# Altium project BLDC controller.PrjPcb
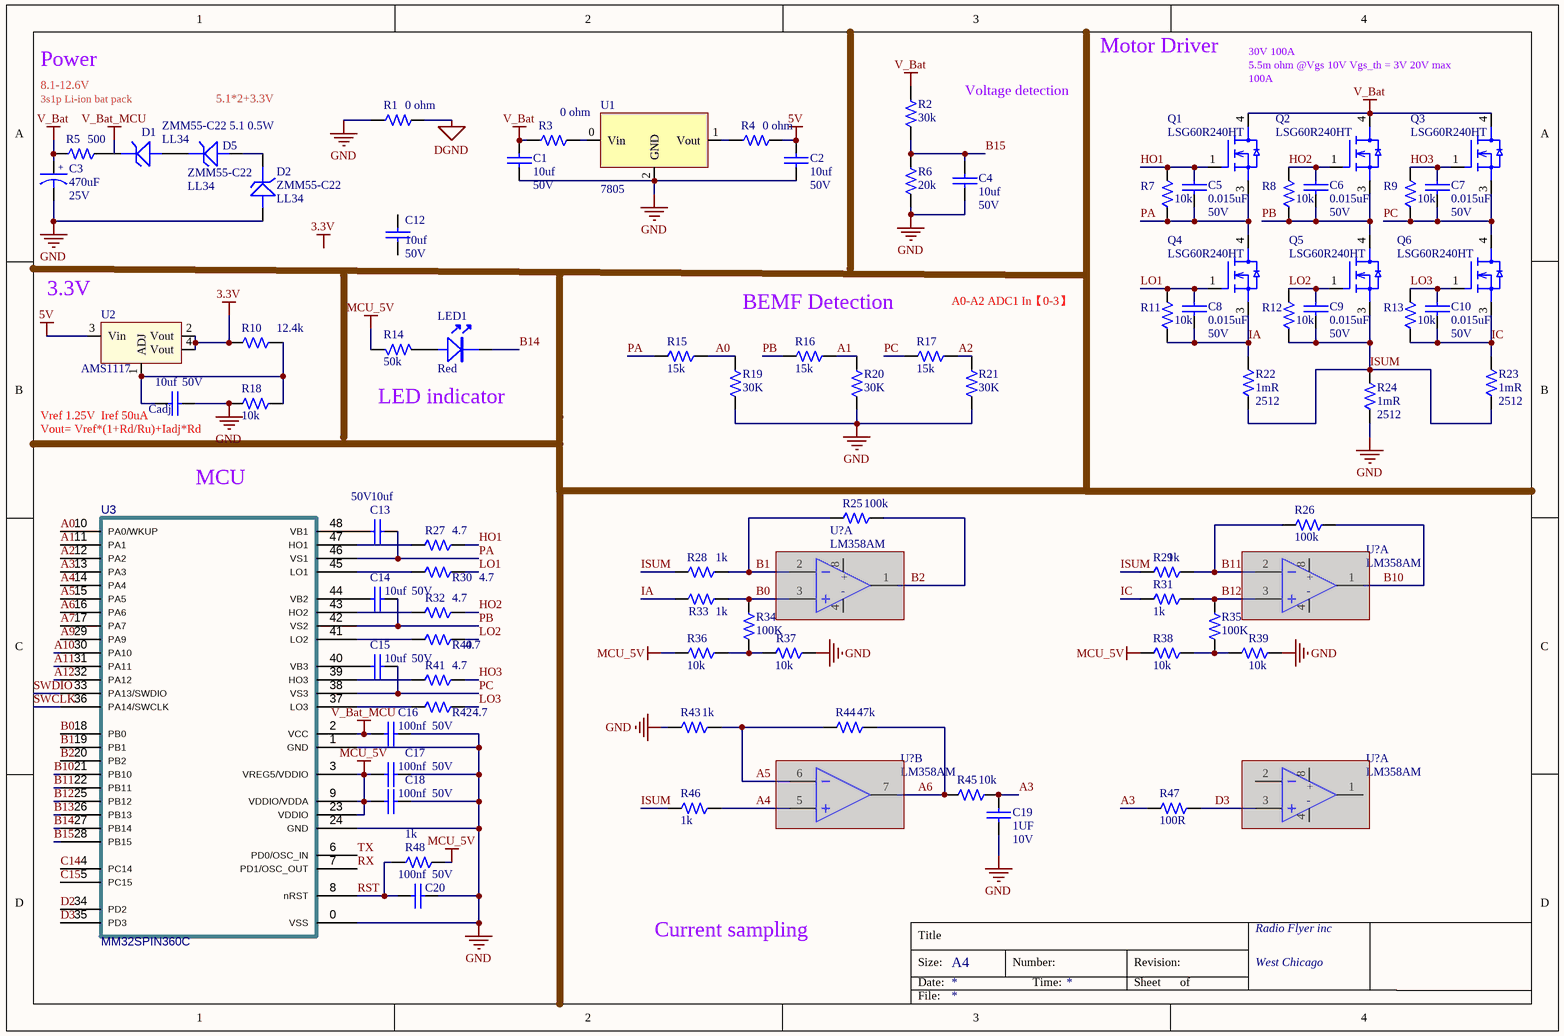
[diagram p0: E-scooter.SchDoc]
2 sheets, 124 parts. Net scope: global (net labels, ports and power ports of the same name join across sheets).
Board file: BLDC controller.PcbDoc
Sheets:
  E-scooter.SchDoc
  Connector.SchDoc

## Sheet E-scooter.SchDoc
size A4; Organization: Altium Limited; Address1: L3, 12a Rodborough Rd; Address2: Frenchs Forest; Address3: NSW; Address4: Australia 2086

### Parts
(Parts that share a designator on the sheet are numbered #1, #2 ... from top to bottom, then left to right.)
C1  value 10uf  Voltage: 50V  [CAPC0603-RW]  (hidden comment: PXL456470-1530)
C2  value 10uf  Voltage: 50V  [CAPC0603-RW]  (hidden comment: PXL456470-1530)
C3  value 470uF  Voltage: 25V  [CASE - G]  (hidden comment: PBE099550-4710)
C4  value 10uf  Voltage: 50V  [CAPC0603-RW]  (hidden comment: PXL456470-1530)
C5  value 0.015uF  Voltage: 50V  [CAPC0603-RW]  (hidden comment: PXL456470-1530)
C6  value 0.015uF  Voltage: 50V  [CAPC0603-RW]  (hidden comment: PXL456470-1530)
C7  value 0.015uF  Voltage: 50V  [CAPC0603-RW]  (hidden comment: PXL456470-1530)
C8  value 0.015uF  Voltage: 50V  [CAPC0603-RW]  (hidden comment: PXL456470-1530)
C9  value 0.015uF  Voltage: 50V  [CAPC0603-RW]  (hidden comment: PXL456470-1530)
C10  value 0.015uF  Voltage: 50V  [CAPC0603-RW]  (hidden comment: PXL456470-1530)
C12  value 10uf  Voltage: 50V  [CAPC0603-RW]  (hidden comment: PXL456470-1530)
C13  value 10uf  Voltage: 50V  [CAPC0603-RW]  (hidden comment: PXL456470-1530)
C14  value 10uf  Voltage: 50V  [CAPC0603-RW]  (hidden comment: PXL456470-1530)
C15  value 10uf  Voltage: 50V  [CAPC0603-RW]  (hidden comment: PXL456470-1530)
C16  value 100nf  Voltage: 50V  [CAPC0603-RW]  (hidden comment: PXL456470-1530)
C17  value 100nf  Voltage: 50V  [CAPC0603-RW]  (hidden comment: PXL456470-1530)
C18  value 100nf  Voltage: 50V  [CAPC0603-RW]  (hidden comment: PXL456470-1530)
C19  value 1UF  Voltage: 10V  [CAPC0603-RW]  (hidden comment: PXL456470-1530)
C20  value 100nf  Voltage: 50V  [CAPC0603-RW]  (hidden comment: PXL456470-1530)
Cadj  value 10uf  Voltage: 50V  [CAPC0603-RW]  (hidden comment: PXL456470-1530)
D1  MFG Part: ZMM55-C22 5.1 0.5W  [LL34]  (hidden comment: RCZ005022-0010)
D2  MFG Part: ZMM55-C22  [LL34]  (hidden comment: RCZ005022-0010)
D5  MFG Part: ZMM55-C22  [LL34]  (hidden comment: RCZ005022-0010)
LED1  Color: Red  [LED1206-RED]  (hidden comment: LED1206R_23-21\R6C-AM1N2AY\2A)
Q1  MFG Part: LSG60R240HT  [TO252-3]  (hidden comment: T5860038503A6)
Q2  MFG Part: LSG60R240HT  [TO252-3]  (hidden comment: T5860038503A6)
Q3  MFG Part: LSG60R240HT  [TO252-3]  (hidden comment: T5860038503A6)
Q4  MFG Part: LSG60R240HT  [TO252-3]  (hidden comment: T5860038503A6)
Q5  MFG Part: LSG60R240HT  [TO252-3]  (hidden comment: T5860038503A6)
Q6  MFG Part: LSG60R240HT  [TO252-3]  (hidden comment: T5860038503A6)
R1  value 0 ohm  [0603-RW]  (hidden comment: T502210202399)
R2  value 30k  [0603]  (hidden comment: T5024421083A9)
R3  value 0 ohm  [0603-RW]  (hidden comment: T502210202399)
R4  value 0 ohm  [0603-RW]  (hidden comment: T502210202399)
R5  value 500  [0603-RW]  (hidden comment: T502210202399)
R6  value 20k  [0603]  (hidden comment: T5024421083A9)
R7  value 10k  [0603]  (hidden comment: T5024421083A9)
R8  value 10k  [0603]  (hidden comment: T5024421083A9)
R9  value 10k  [0603]  (hidden comment: T5024421083A9)
R10  value 12.4k  [0603]  (hidden comment: T5024421083A9)
R11  value 10k  [0603]  (hidden comment: T5024421083A9)
R12  value 10k  [0603]  (hidden comment: T5024421083A9)
R13  value 10k  [0603]  (hidden comment: T5024421083A9)
R14  value 50k  [0603]  (hidden comment: T5024421083A9)
R15  value 15k  [0603]  (hidden comment: T5024421083A9)
R16  value 15k  [0603]  (hidden comment: T5024421083A9)
R17  value 15k  [0603]  (hidden comment: T5024421083A9)
R18  value 10k  [0603]  (hidden comment: T5024421083A9)
R19  value 30K  [0603]  (hidden comment: T5024421083A9)
R20  value 30K  [0603]  (hidden comment: T5024421083A9)
R21  value 30K  [0603]  (hidden comment: T5024421083A9)
R22  value 1mR  [2512]  (hidden comment: QCF101250-1009)
R23  value 1mR  [2512]  (hidden comment: QCF101250-1009)
R24  value 1mR  [2512]  (hidden comment: QCF101250-1009)
R25  value 100k  [0603]  (hidden comment: T5024421083A9)
R26  value 100k  [0603]  (hidden comment: T5024421083A9)
R27  value 4.7  [0603]  (hidden comment: T5024421083A9)
R28  value 1k  [0603]  (hidden comment: T5024421083A9)
R29  value 1k  [0603]  (hidden comment: T5024421083A9)
R30  value 4.7  [0603]  (hidden comment: T5024421083A9)
R31  value 1k  [0603]  (hidden comment: T5024421083A9)
R32  value 4.7  [0603]  (hidden comment: T5024421083A9)
R33  value 1k  [0603]  (hidden comment: T5024421083A9)
R34  value 100K  [0603]  (hidden comment: T5024421083A9)
R35  value 100K  [0603]  (hidden comment: T5024421083A9)
R36  value 10k  [0603]  (hidden comment: T5024421083A9)
R37  value 10k  [0603]  (hidden comment: T5024421083A9)
R38  value 10k  [0603]  (hidden comment: T5024421083A9)
R39  value 10k  [0603]  (hidden comment: T5024421083A9)
R40  value 4.7  [0603]  (hidden comment: T5024421083A9)
R41  value 4.7  [0603]  (hidden comment: T5024421083A9)
R42  value 4.7  [0603]  (hidden comment: T5024421083A9)
R43  value 1k  [0603]  (hidden comment: T5024421083A9)
R44  value 47k  [0603]  (hidden comment: T5024421083A9)
R45  value 10k  [0603]  (hidden comment: T5024421083A9)
R46  value 1k  [0603]  (hidden comment: T5024421083A9)
R47  value 100R  [0603]  (hidden comment: T5024421083A9)
R48  value 1k  [0603]  (hidden comment: T5024421083A9)
U1  7805  [TO-263]
U2  AMS1117  [SOT223]
U3  MM32SPIN360C  [QFN48-6x6]
U?#1  MFG Part: LM358AM  [SO8]  (hidden comment: T610500042101)  (part A of 2)  (masked out: inside a compile mask, not in the netlist)
U?#2  MFG Part: LM358AM  [SO8]  (hidden comment: T610500042101)  (part A of 2)  (masked out: inside a compile mask, not in the netlist)
U?#3  MFG Part: LM358AM  [SO8]  (hidden comment: T610500042101)  (part B of 2)  (masked out: inside a compile mask, not in the netlist)
U?#4  MFG Part: LM358AM  [SO8]  (hidden comment: T610500042101)  (part A of 2)  (masked out: inside a compile mask, not in the netlist)

### Nets
3.3V: R10.2 U2.2(Vout) U2.4(Vout)
5V: C2.1 R4.2 U2.3(Vin)
DGND: R1.2
GND: C1.2 C2.2 C3.2 C4.2 C16.1 C17.1 C18.1 C19.1 C20.1 Cadj.2 D2.1(A) R1.1 R6.2 R18.2 R19.2 R20.2 R21.2 R24.1 R37.1 R39.1 R43.2 U1.2(GND) U3.0(VSS) U3.1(GND) U3.24(GND)
MCU_5V: C17.2 C18.2 R14.1 R36.2 R38.2 R48.2 U3.3(VREG5/VDDIO) U3.9(VDDIO/VDDA) U3.23(VDDIO)
V_Bat: C1.1 C3.1 Q1.4(D) Q2.4(D) Q3.4(D) R2.1 R3.1 R5.1
V_Bat_MCU: C16.2 U3.2(VCC)
A0: R15.1 R19.1 U3.10(PA0/WKUP)
A1: R16.1 R20.1 U3.11(PA1)
A2: R17.1 R21.1 U3.12(PA2)
A3: C19.2 R45.1 R47.2 U3.13(PA3)
A4: R46.1 U3.14(PA4)
A5: R43.1 R44.2 U3.15(PA5)
A6: R44.1 R45.2 U3.16(PA6)
A7: U3.17(PA7)
A9: U3.29(PA9)
A10: U3.30(PA10)
A11: U3.31(PA11)
A12: U3.32(PA12)
B0: R33.1 R34.1 U3.18(PB0)
B1: R25.2 R28.1 U3.19(PB1)
B2: R25.1 U3.20(PB2)
B10: R26.1 U3.21(PB10)
B11: R26.2 R29.1 U3.22(PB11)
B12: R31.1 R35.1 U3.25(PB12)
B13: U3.26(PB13)
B14: LED1.2(K) U3.27(PB14)
B15: C4.1 R2.2 R6.1 U3.28(PB15)
C14: U3.4(PC14)
C15: U3.5(PC15)
D2: U3.34(PD2)
D3: R47.1 U3.35(PD3)
HO1: C5.2 Q1.1(G) R7.2 R27.1
HO2: C6.2 Q2.1(G) R8.2 R32.1
HO3: C7.2 Q3.1(G) R9.2 R41.1
IA: C8.1 Q4.3(S) R11.1 R22.2 R33.2
IC: C10.1 Q6.3(S) R13.1 R23.2 R31.2
ISUM: C9.1 Q5.3(S) R12.1 R22.1 R23.1 R24.2 R28.2 R29.2 R46.2
LO1: C8.2 Q4.1(G) R11.2 R30.1
LO2: C9.2 Q5.1(G) R12.2 R40.1
LO3: C10.2 Q6.1(G) R13.2 R42.1
PA: C5.1 C13.1 Q1.3(S) Q4.4(D) R7.1 R15.2 U3.46(VS1)
PB: C6.1 C14.1 Q2.3(S) Q5.4(D) R8.1 R16.2 U3.42(VS2)
PC: C7.1 C15.1 Q3.3(S) Q6.4(D) R9.1 R17.2 U3.38(VS3)
RST: C20.2 R48.1 U3.8(nRST)
RX: U3.7(PD1/OSC_OUT)
SWCLK: U3.36(PA14/SWCLK)
SWDIO: U3.33(PA13/SWDIO)
TX: U3.6(PD0/OSC_IN)
NetC13_2: C13.2 U3.48(VB1)
NetC14_2: C14.2 U3.44(VB2)
NetC15_2: C15.2 U3.40(VB3)
NetCadj_1: Cadj.1 R10.1 R18.1 U2.1(ADJ)
NetD1_1: D1.1(A) D5.2(K)
NetD1_2: D1.2(K) R5.2
NetD2_2: D2.2(K) D5.1(A)
NetLED1_1: LED1.1(A) R14.2
NetR3_2: R3.2 U1.0(Vin)
NetR4_1: R4.1 U1.1(Vout)
NetR27_2: R27.2 U3.47(HO1)
NetR30_2: R30.2 U3.45(LO1)
NetR32_2: R32.2 U3.43(HO2)
NetR34_2: R34.2 R36.1 R37.2
NetR35_2: R35.2 R38.1 R39.2
NetR40_2: R40.2 U3.41(LO2)
NetR41_2: R41.2 U3.39(HO3)
NetR42_2: R42.2 U3.37(LO3)

Not connected (* = marked no-connect by the designer): C12 1 2

### Notes on the sheet
- Power
- 3s1p Li-ion bat pack
- 8.1-12.6V
- 5.1*2+3.3V
- Voltage detection
- Motor Driver
- 30V 100A
- 5.5m ohm @Vgs 10V Vgs_th = 3V 20V max
- (near Q1) 100A
- (near U2) 3.3V
- BEMF Detection
- A0-A2 ADC1 In【0-3】
- (near Cadj) Vref 1.25V  Iref 50uA
- (near Cadj) Vout= Vref*(1+Rd/Ru)+Iadj*Rd
- LED indicator
- (near U3) MCU
- Current sampling
- Labels drawn without touching a wire or pin: 3.3V
- Title
- Size:
- Date:
- A4
- Number:
- Time:
- Revision:
- Sheet
- of
- Radio Flyer inc
- West Chicago
- File:
- (in symbol CAP E 470uF 25V 20% SMD) +
- (in symbol LM358BAIDR, part A) +; -

### Library data of the parts
C1 C2 C4-C10 C12-C20 = CAP0603 0.015uF 50V 10%: GP CHIP CAP 0.015uF 50V 10% 0603 TYPE X7R; SAP: T542021537508; Vendor Code: 10010262; Vendor Name: 东莞市晴远电子有限公司; Type: Capacitor; DIP&SMD: SMD; PACKAGE: CAPC0603; MFG: *; MFG Part: *; Other: X7R; Tolerance: 10%; Customer Specific: N/A
C3 = CAP E 470uF 25V 20% SMD: CHIP ELECT 470uF 25V 20% D10xL10 105; SAP: T551471445000; Vendor Name: 东莞市晴远电子有限公司; Vendor Code: 10010262; Type: Capacitor; DIP&SMD: SMD; PACKAGE: CASE - G; MFG: *; MFG Part: *; Other: *; Tolerance: 20%; Customer Specific: N/A
Cadj = CAP0603 0.015uF 50V 10%: GP CHIP CAP 0.015uF 50V 10% 0603 TYPE X7R; SAP: T542021537508; Vendor Code: 10010262; Vendor Name: 东莞市晴远电子有限公司; DIP&SMD: SMD; PACKAGE: CAPC0603; MFG: *; MFG Part: *; Other: X7R; Tolerance: 10%; Type: Capacitor; Customer Specific: N/A
D1 D2 D5 = ZMM55-C22-10020343: CHIP ZENER 22V 5% 0.5W MLL34; SAP: T573003862018; Vendor Name: 深圳市春明电子有限公司; Current: 5MA; Power: 500MW; DIP&SMD: SMD; Vendor Code: 10020343; MFG: *; Tolerance: 5%; VOLTAGE: 22V; Type: ZENER; Customer Specific: N/A; Package: LL34
LED1 = LED1206R_23-21\R6C-AM1N2AY\2A: CHIP LED RED TYPE 1206; MFG: EVERLIGHT; DIP&SMD: SMD; CREATE_NAME: Nathan; MFG Part: 23-21\R6C-AM1N2AY\2A; SAP: *; Package: 1206; Type: LED; CREATE_TIME: 18-Aug-2020
Q1-Q6 = NMOS LSG60R240HT: NMOS 600V LSG60R240HT TO252( LONTEN K; Current: 17A; Type: N-CHANNEL MOSFET; CREATE_NAME: Nathan; DIP&SMD: SMD; SAP: T5860038503A6; Pd: *; Vendor Code: *; Vendor Name: *; Voltage: 600V; MFG: LONTEN; CREATE_TIME: 12-Oct-2019; Rds: *; Customer Specific: N/A; Package: TO252
R1 R3-R5 = RES0603 1/16W 1% 21K OMH_WALSIN: CHIP 21K OHM 100PPM +-1% 0603 WALS L; TOL: 1%; MFG: WALSIN (華新); Power: 1/10W; CREATE_NAME: Nathan; DIP&SMD: SMD; SAP: T502210202399; Package: 0603; MFG Part: *; Vendor Code: *; Vendor Name: *; Type: Resistor; CREATE_TIME: 08-Feb-2018; Customer Specific: N/A
R2 R6-R21 R25-R48 = RES0201 1/20W 1% 4.42K OHM_WALSIN: CHIP 4.42K OHM 200PPM +-1% 0201 WALS L; MFG Part: WR02X4421FAL; Power: 1/20W; MFG: WALSIN (華新); TOL: 1%; CREATE_NAME: Nathan; DIP&SMD: SMD; Vendor Code: *; SAP: T5024421083A9; Vendor Name: *; Type: Resistor; PACKAGE: 0603; CREATE_TIME: 23-July-2019; Customer Specific: N/A
R22-R24 = RES2512 1W 1% 10 OHM: CHIP RES. 10 OHM 1W 1% 2512; Vendor Code: 10010262; SAP: T502100A07399; Vendor Name: 东莞市晴远电子有限公司; DIP&SMD: SMD; Power: 1W; MFG Part: *; MFG: *; TOL: 1%; Type: Resistor; Customer Specific: N/A; PACKAGE: 2512
U2 = AMS1117: 800mA LOW DROPOUT VOLTAGE REGULATOR , SOT-223; MFG: Advanced Monolithic Systems; CREATE_NAME: Nathan; DIP&SMD: SMD; SAP: *; Vendor Code: *; Vendor Name: *; Type: IC; CREATE_TIME: 17-Nov-2020; Package: SOT-223; Customer Specific: N/A; MFG Part: AMS1117
U?#1-U?#4 = LM358BAIDR: OP LM358BAIDR SOIC(8) TI K; CREATE_NAME: Tom; DIP&SMD: SMD; SAP: T610500042101; CREATE_TIME: 04-Jan-2020; MFG: TI; Type: IC; Customer Specific: N/A
U3 = MM32SPIN360C: Published: 30-May-2008; DatasheetVersion: rev6, Mar-2008; PackageVersion: Mar-2008; PackageReference: LQFP48; Publisher: Altium Limited; PackageDescription: 48-Pin Low-Profile Quad Flat Pack, 7 x 7 mm Body, 0.5 mm Pitch (LQFP48); ComponentLink1Description: Manufacturer Link; ComponentLink1URL: www.st.com/stm32; ComponentLink2Description: Datasheet; ComponentLink2URL: http://www.st.com/stonline/products/literature/ds/13587.pdf

## Sheet Connector.SchDoc
size A4; Organization: Altium Limited; Address1: L3, 12a Rodborough Rd; Address2: Frenchs Forest; Address3: NSW; Address4: Australia 2086
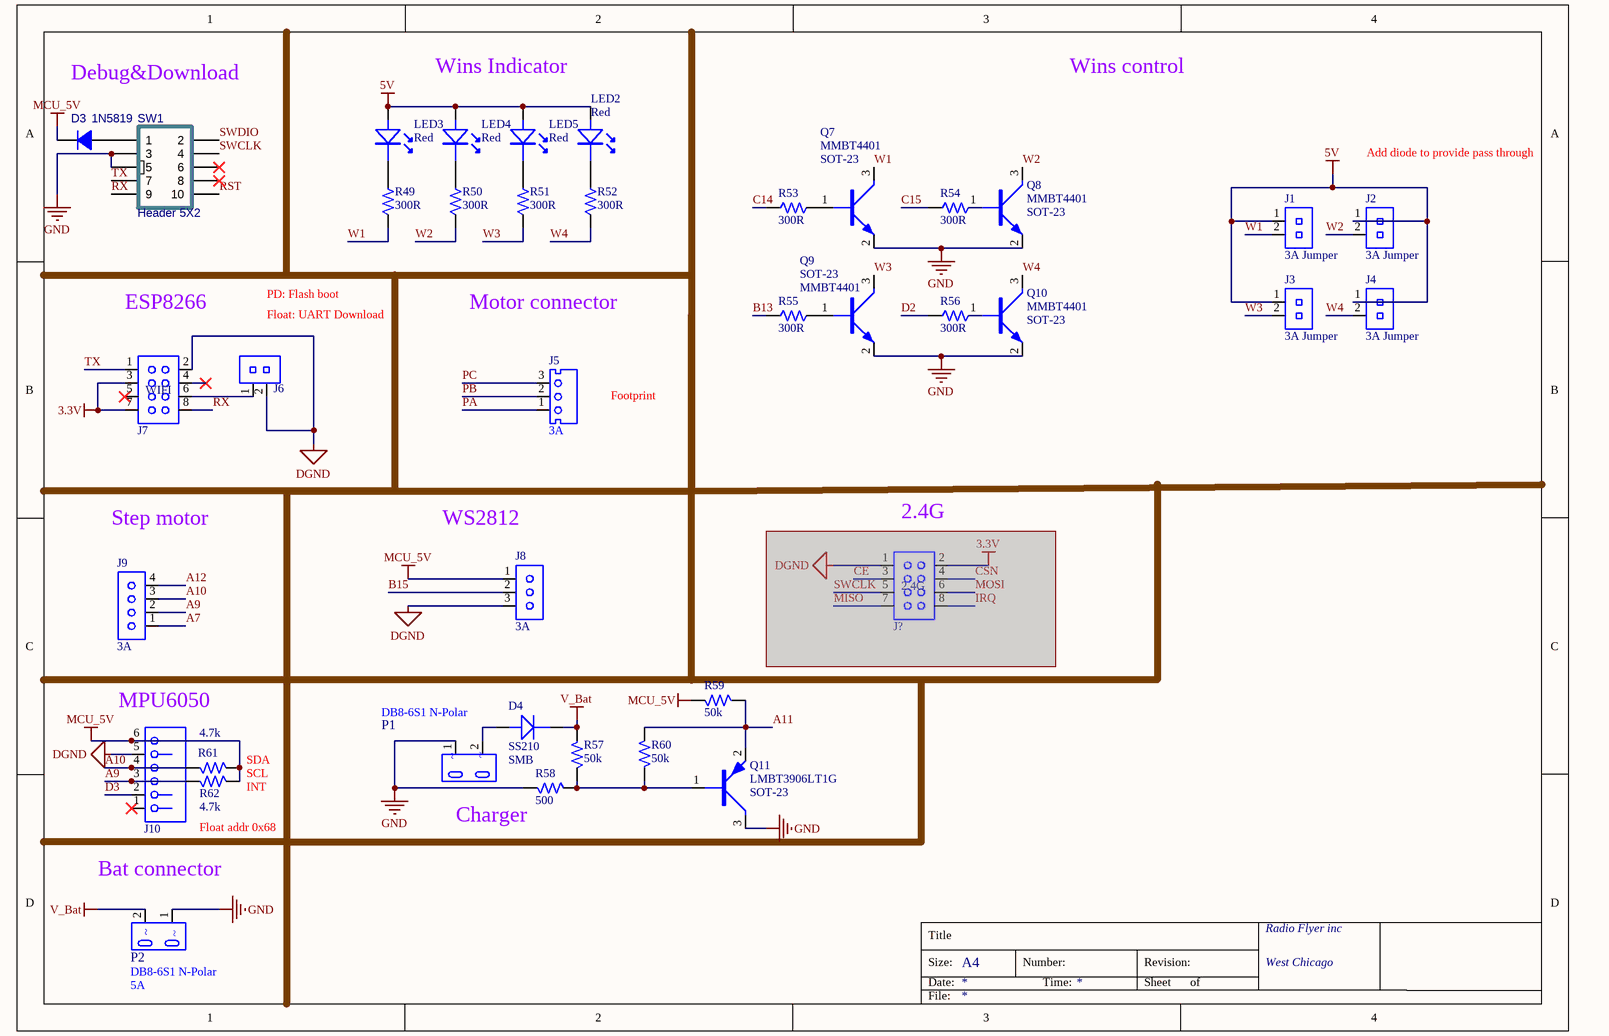
[diagram p1: Connector.SchDoc]

### Parts
D3  1N5819  [SOD-123-L]
D4  RCD102100-0110  [SMB]  (value not drawn)
J1  Current: 3A Jumper  [HOUSING 2P PH=2.54mm Jumper]  (hidden comment: CCH254020-0102)
J2  Current: 3A Jumper  [HOUSING 2P PH=2.54mm Jumper]  (hidden comment: CCH254020-0102)
J3  Current: 3A Jumper  [HOUSING 2P PH=2.54mm Jumper]  (hidden comment: CCH254020-0102)
J4  Current: 3A Jumper  [HOUSING 2P PH=2.54mm Jumper]  (hidden comment: CCH254020-0102)
J5  Current: 3A  [CONN 3P PH=2.5mm B3B-XH-A]  (hidden comment: CCN250000-0103)
J6  CCH254020-0102  [HOUSING 2P PH=2.54mm Jumper]  (value not drawn)
J7  WIFI  [HEAD 8P 2X4 PH=2.54mm 90 H5mm_2.54-2X4AW-10.4]
J8  Current: 3A  [HEAD 3P PH=2.54mm 180]  (hidden comment: CCP254010-0103)
J9  Current: 3A  [HEAD 4P PH=2.54mm 180]  (hidden comment: CCP254260-0104)
J10  T690300121600  [CONN 6P PH=2.5mm RA XHB-6AW-KL]  (value not drawn)
J?  2.4G  [HEAD 8P 2X4 PH=2.54mm 90 H5mm_2.54-2X4AW-10.4]  (masked out: inside a compile mask, not in the netlist)
LED2  Color: Red  [3mm LED-R]  (hidden comment: KED200001-0010)
LED3  Color: Red  [3mm LED-R]  (hidden comment: KED200001-0010)
LED4  Color: Red  [3mm LED-R]  (hidden comment: KED200001-0010)
LED5  Color: Red  [3mm LED-R]  (hidden comment: KED200001-0010)
P1  MFG Part: DB8-6S1 N-Polar  [AC INLET 2P DB8-6S1]  (hidden comment: CJP012009-0050)
P2  MFG Part: DB8-6S1 N-Polar  Current: 5A  [Motor connector]  (hidden comment: CJP012009-0050)
Q7  Package: SOT-23  [SOT23-132-RW]  (hidden comment: MMBT4401)
Q8  Package: SOT-23  [SOT23-132-RW]  (hidden comment: MMBT4401)
Q9  Package: SOT-23  [SOT23-132-RW]  (hidden comment: MMBT4401)
Q10  Package: SOT-23  [SOT23-132-RW]  (hidden comment: MMBT4401)
Q11  MFG Part: LMBT3906LT1G  Package: SOT-23  [SOT23-132-RW]  (hidden comment: RCP003906-0002)
R49  value 300R  [0603]  (hidden comment: T5024421083A9)
R50  value 300R  [0603]  (hidden comment: T5024421083A9)
R51  value 300R  [0603]  (hidden comment: T5024421083A9)
R52  value 300R  [0603]  (hidden comment: T5024421083A9)
R53  value 300R  [0603]  (hidden comment: T5024421083A9)
R54  value 300R  [0603]  (hidden comment: T5024421083A9)
R55  value 300R  [0603]  (hidden comment: T5024421083A9)
R56  value 300R  [0603]  (hidden comment: T5024421083A9)
R57  value 50k  [0603]  (hidden comment: T5024421083A9)
R58  value 500  [0603]  (hidden comment: T5024421083A9)
R59  value 50k  [0603]  (hidden comment: T5024421083A9)
R60  value 50k  [0603]  (hidden comment: T5024421083A9)
R61  value 4.7k  [0603]  (hidden comment: T5024421083A9)
R62  value 4.7k  [0603]  (hidden comment: T5024421083A9)
SW1  Header 5X2  [HDR2X5]

### Nets
3.3V: J7.3 J7.7
5V: J1.1 J2.1 J3.1 J4.1 LED2.1(A) LED3.1(A) LED4.1(A) LED5.1(A)
DGND: J6.2 J7.2 J8.3 J10.5
GND: P1.1 P2.1 Q7.2(E) Q8.2(E) Q9.2(E) Q10.2(E) Q11.3(C) R58.1 SW1.3 SW1.5
MCU_5V: D3.K J8.1 J10.6 R59.2 R61.2 R62.2
V_Bat: D4.2(K) P2.2 R57.1
A7: J9.1
A9: J9.2 J10.3 R62.1
A10: J9.3 J10.4 R61.1
A11: Q11.2(E) R59.1 R60.2
A12: J9.4
B13: R55.1
B15: J8.2
C14: R53.1
C15: R54.1
D2: R56.1
D3: J10.2
PA: J5.1
PB: J5.2
PC: J5.3
RST: SW1.10
RX: J7.8 SW1.9
SWCLK: SW1.4
SWDIO: SW1.2
TX: J7.1 SW1.7
W1: J1.2 Q7.3(C) R49.2
W2: J2.2 Q8.3(C) R50.2
W3: J3.2 Q9.3(C) R51.2
W4: J4.2 Q10.3(C) R52.2
NetD3_A: D3.A SW1.1
NetD4_1: D4.1(A) P1.2
NetJ6_1: J6.1 J7.6
NetLED2_2: LED2.2(K) R52.1
NetLED3_2: LED3.2(K) R49.1
NetLED4_2: LED4.2(K) R50.1
NetLED5_2: LED5.2(K) R51.1
NetQ7_1: Q7.1(B) R53.2
NetQ8_1: Q8.1(B) R54.2
NetQ9_1: Q9.1(B) R55.2
NetQ10_1: Q10.1(B) R56.2
NetQ11_1: Q11.1(B) R57.2 R58.2 R60.1

Not connected (* = marked no-connect by the designer): J7 4* 5*; J10 1*; SW1 6* 8*

### Notes on the sheet
- Debug&Download
- Wins Indicator
- Wins control
- Add diode to provide pass through
- ESP8266
- PD: Flash boot
- Motor connector
- Float: UART Download
- Footprint
- (near J?) 2.4G
- Step motor
- (near J8) WS2812
- (near J10) MPU6050
- SDA
- SCL
- INT
- Float addr 0x68
- (near R58) Charger
- Bat connector
- Title
- Size:
- Date:
- A4
- Number:
- Time:
- Revision:
- Sheet
- of
- Radio Flyer inc
- West Chicago
- File:
- (in symbol AC INLET 2P DB8-6S1 N-Polar) ~

### Library data of the parts
D3 = Diode: 普通二极管 Diode; Imax: 500mA; Published: 8-Jun-2000; Revision: July-2002: Re-released for DXP Platform.; Publisher: Altium Limited; Price(RMB): 0.000
D4 = SS210: SWITC 100V 2A SS210 MIC G; SAP: T572005362246; Vendor Name: 深圳市春明电子有限公司; Vendor Code: 10020343; Type: DIODE; Optional: USD (和572004962246 交易幣別不一樣)帋ISHIDDEN=T|IS|IS|IS|IS|IS|IS; DIP&SMD: SMD; MFG: MIC; Voltage: 100V; Current: 2A; Customer Specific: N/A; MFG Part: SS210; Package: SMB
J1-J4 = HOUSING 2P PH=2.54mm Jumper: HOUSING SIL Jumper 2P 90059-1007 Molex; Value: 2.54mm; SAP: T690300000900; Vendor Name: 深圳市利民丰电子有限公司; Vendor Code: 10020373; DIP&SMD: DIP; MFG: *; MFG Part: *; Type: Connector
J5 = CONN 3P PH=2.5mm B3B-XH-A: GP CONNECTOR B3B-XH-A 3 PIN; Value: 2.5mm; SAP: T690300028900; Vendor Name: 亿源电子有限公司; Vendor Code: 10009989; DIP&SMD: DIP; MFG: *; MFG Part: *; Type: Connector
J6 = HOUSING 2P PH=2.54mm Jumper: HOUSING SIL Jumper 2P 90059-1007 Molex; Value: 2.54mm; SAP: T690300000900; Vendor Name: 深圳市利民丰电子有限公司; Vendor Code: 10020373; DIP&SMD: DIP; Current: 3A Jumper; MFG: *; MFG Part: *; Type: Connector
J7 J? = HEAD 8P 2X4 PH=2.54mm 90 H5mm_2.54-2X4AW-10.4: 2X4P P:2.54MM 90° DIP K; Value: 2.54mm; SAP: T690300110000; MFG: JINJIA; CREATE_NAME: Nathan; MFG Part: 2.54-2X4AW-10.4; Vendor Name: *; Vendor Code: *; Type: Connector; Current: *; CREATE_TIME: 12-Sep-2017; DIP&SMD: DIP
J8 = HEAD 3P PH=2.54mm 180: HEAD PIN 3P P2.54*H11.6MM; Value: 2.54mm; SAP: T690300031100; Vendor Name: 深圳市利民丰电子有限公司; Vendor Code: 10020373; DIP&SMD: DIP; MFG: *; MFG Part: *; Type: Connector
J9 = HEAD 4P PH=2.54mm 180 H11.5mm: HEAD PIN 4P P2.54xH11.5MM; Value: 2.54mm; SAP: T690300023200; Vendor Name: 亿源电子有限公司; Vendor Code: 10009989; DIP&SMD: DIP; MFG: *; MFG Part: *; Type: Connector
J10 = CONN PH 6P PH=2.5mm RA XHB-6AW-KL: CONNECTOR 6PIN P=2.5 WHITE 90 K; Value: 2.5mm; MFG: 金佳电子; CREATE_NAME: Nathan; DIP&SMD: DIP; SAP: T690300121600; MFG Part: XHB-6AW-KL; Vendor Name: *; Vendor Code: *; Type: Connector; Current: *; CREATE_TIME: 27-Sep-2017
LED2-LED5 = FH-F303DNREH: RED LED 2PIN 3 HIGH LIGHT FH-F303DNREH; SAP: T575009720159; Vendor Code: 10020224; Vendor Name: 深圳市富毅华科技有限公司; MFG: 富毅华; Voltage: 2V; DIP&SMD: DIP; MFG Part: FH-F303DNREH; Type: LED
P1 = AC INLET 2P DB8-6S1 N-Polar: AC SOCKET 2P D2.36 2.5A 250V VDE BLACK; SAP: T690300011500; MFG: 金明浩; Vendor Name: 深圳市金明浩电子科技有限公司; Vendor Code: 10010007; DIP&SMD: DIP; Current: 5A; Value: *; Type: Connector
P2 = AC INLET 2P DB8-6S1 N-Polar: AC SOCKET 2P D2.36 2.5A 250V VDE BLACK; SAP: T690300011500; MFG: 金明浩; Vendor Name: 深圳市金明浩电子科技有限公司; Vendor Code: 10010007; DIP&SMD: DIP; Value: *; Type: Connector
Q7-Q10 = MMBT4401: NPN 40V MMBT4401 SOT23 FAIRCH K; MFG: FAIRCHILD; DIP&SMD: SMD; CREATE_NAME: Nathan; SAP: *; Vendor Code: *; Vendor Name: *; Power: *; Voltage: *; Type: NPN; Customer Specific: N/A; CREATE_TIME: 29-Dec-2020; MFG Part: MMBT4401
Q11 = LMBT3906LT1G_LRC: PNP 40V LMBT3906LT1G SOT23 LRC L; SAP: T582002540437; Vendor Code: 10020356; Vendor Name: 汉秥（香港）电子有限公司; DIP&SMD: SMD; MFG: LRC; Power: *; Voltage: *; Type: PNP; Customer Specific: N/A
R49-R62 = RES0201 1/20W 1% 4.42K OHM_WALSIN: as R2 on sheet E-scooter; Vendor Code: *; SAP: T5024421083A9; Vendor Name: *; Type: Resistor; PACKAGE: 0603; CREATE_TIME: 23-July-2019; Customer Specific: N/A
SW1 = Header 5X2: Header, 5-Pin, Dual row; LatestRevisionDate: 17-Jul-2002; LatestRevisionNote: Re-released for DXP Platform.; Publisher: Altium Limited; Price(RMB): 0.00

## Nets that join several sheets
3.3V: E-scooter (R10.2 U2.2 U2.4), Connector (J7.3 J7.7)
5V: E-scooter (C2.1 R4.2 U2.3), Connector (8 pins)
DGND: E-scooter (R1.2), Connector (J6.2 J7.2 J8.3 J10.5)
GND: E-scooter (25 pins), Connector (10 pins)
MCU_5V: E-scooter (9 pins), Connector (6 pins)
V_Bat: E-scooter (8 pins), Connector (D4.2 P2.2 R57.1)
A7: E-scooter (U3.17), Connector (J9.1)
A9: E-scooter (U3.29), Connector (J9.2 J10.3 R62.1)
A10: E-scooter (U3.30), Connector (J9.3 J10.4 R61.1)
A11: E-scooter (U3.31), Connector (Q11.2 R59.1 R60.2)
A12: E-scooter (U3.32), Connector (J9.4)
B13: E-scooter (U3.26), Connector (R55.1)
B15: E-scooter (C4.1 R2.2 R6.1 U3.28), Connector (J8.2)
C14: E-scooter (U3.4), Connector (R53.1)
C15: E-scooter (U3.5), Connector (R54.1)
D2: E-scooter (U3.34), Connector (R56.1)
D3: E-scooter (R47.1 U3.35), Connector (J10.2)
PA: E-scooter (7 pins), Connector (J5.1)
PB: E-scooter (7 pins), Connector (J5.2)
PC: E-scooter (7 pins), Connector (J5.3)
RST: E-scooter (C20.2 R48.1 U3.8), Connector (SW1.10)
RX: E-scooter (U3.7), Connector (J7.8 SW1.9)
SWCLK: E-scooter (U3.36), Connector (SW1.4)
SWDIO: E-scooter (U3.33), Connector (SW1.2)
TX: E-scooter (U3.6), Connector (J7.1 SW1.7)